# Altium schematic sheet DB4100_POW_v0.3.SchDoc
size A4
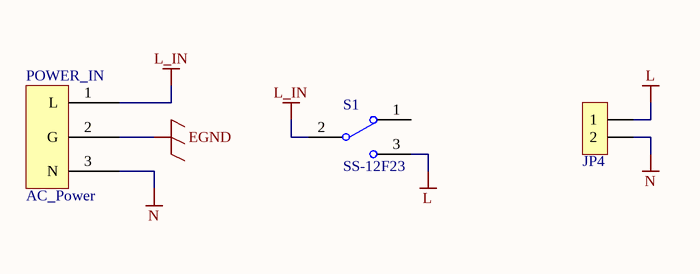
[diagram p0: DB4100_POW_v0.3.SchDoc]

## Parts
JP4  HDR-1X2  [VH3.96-3A_2P_R]  (value not drawn)
POWER_IN  AC_Power  [POWER_M]
S1  SS-12F23  [SS11-BBIWJ-R20-R]

## Nets
EGND: POWER_IN.2(G)
L: JP4.1 S1.3
L_IN: POWER_IN.1(L) S1.2
N: JP4.2 POWER_IN.3(N)

Not connected (* = marked no-connect by the designer): S1 1

## Library data of the parts
JP4 = Header 2: 2P接插件; 版权归属: 源创客; BOM名称: 2P接插件; 学习资源: www.ooocke.com
POWER_IN = AC_Power: AC电源插座
S1 = SSW-1P: 1路波动开关; BOM名称: 波动开关; 版权归属: 源创客; 学习资源: www.ooocke.com